# EasyEDA Pro project esp_4g_gp10-a.eprj

# Schematic Schematic1
Board Name: Board1; Create Date: 2025-06-18; Page Name: P1; Project Name: esp_4g_gp10-a; Schematic Name: Schematic1; Update Date: 2025-06-18; Company: 嘉立创EDA; Page Size: A4; Version: V1.0
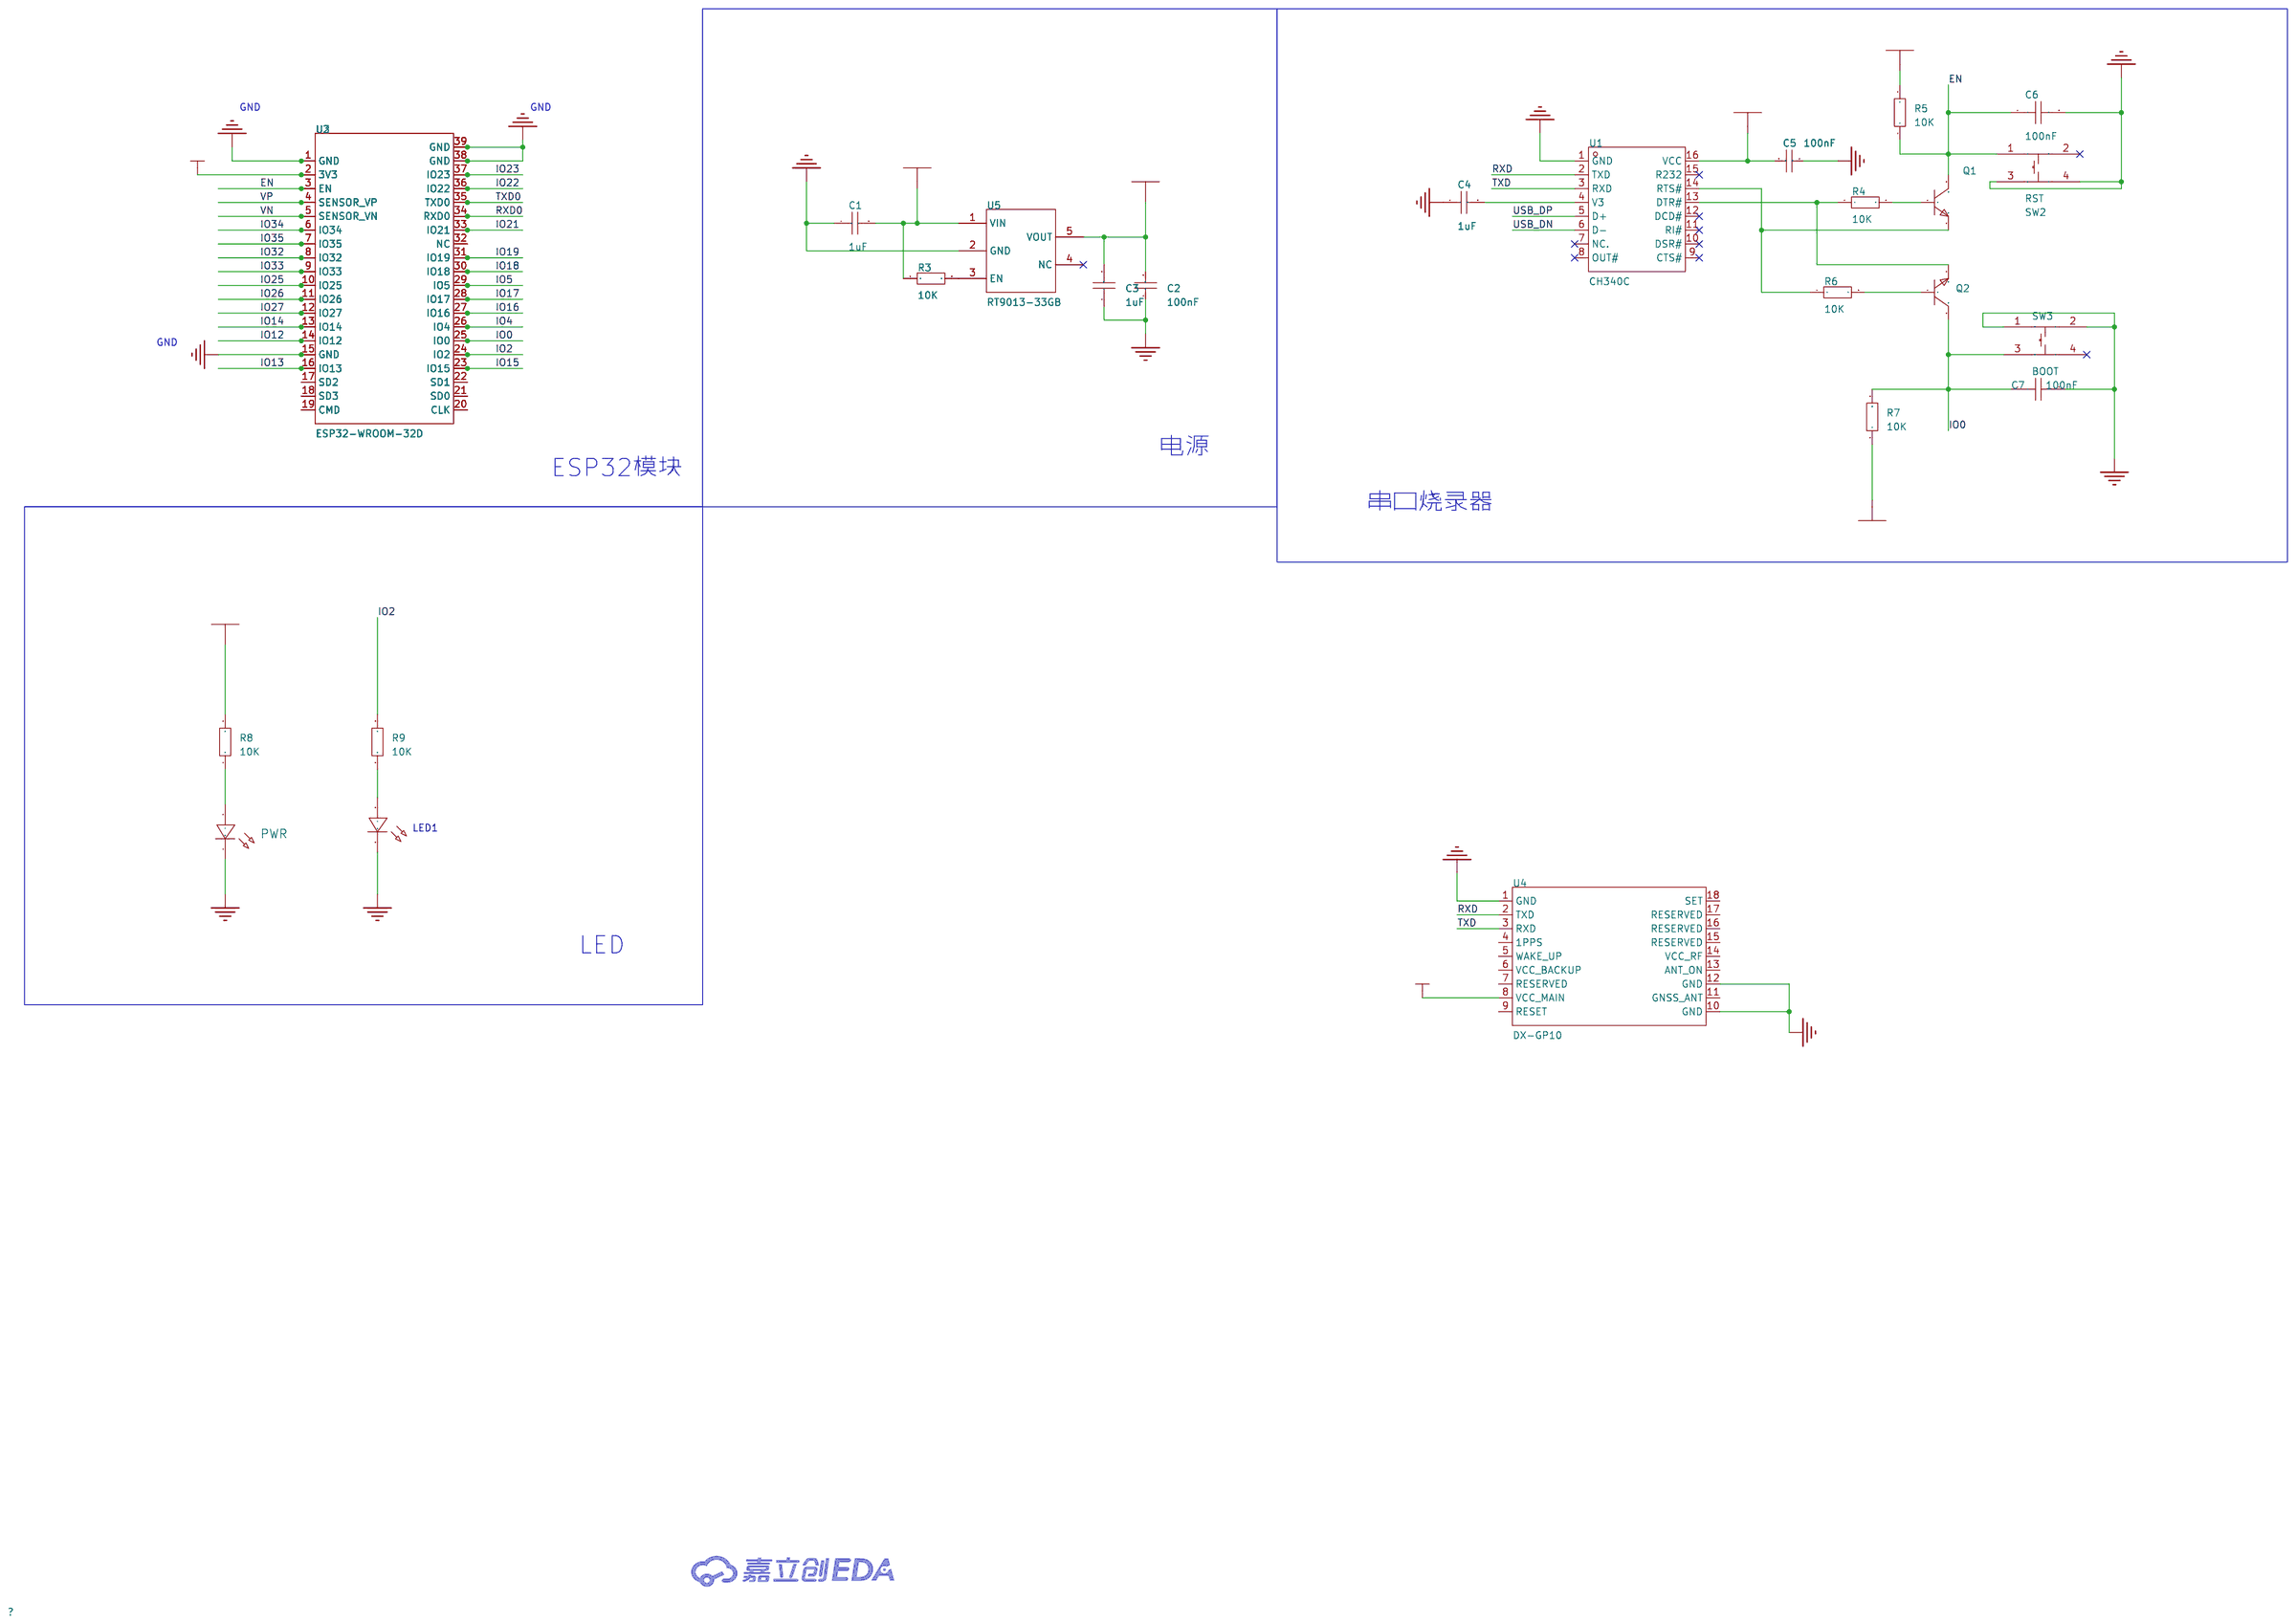
[diagram p0: schematic sheet]

## Parts
C1  1uF  [C0603]
C2  100nF  [C0402]
C3  1uF  [C0603]
C4  1uF  [C0603]
C5  100nF  [C0402]
C6  100nF  [C0603]
C7  100nF  [C0603]
LED1  -  [LED_0603]
PWR  -  [LED_0603]
Q1  -  [S8050_SOT-23]
Q2  -  [S8050_SOT-23]
R3  10K  [R0603]
R4  10K  [R0603]
R5  10K  [R0603]
R6  10K  [R0603]
R7  10K  [R0603]
R8  10K  [R0603]
R9  10K  [R0603]
SW2  RST  [KEY-SMD_4P-L4.2-W3.2-P2.20-LS4.6]
SW3  BOOT  [KEY-SMD_4P-L4.2-W3.2-P2.20-LS4.6]
U1  CH340C  [SOP-16_L10.0-W3.9-P1.27-LS6.0-BL]
U2  ESP32-WROOM-32D  [WIFIM-SMD_ESP32-WROOM-32D]
U3  ESP32-WROOM-32D  [WIFIM-SMD_ESP32-WROOM-32D]
U4  DX-GP10  [COMM-SMD_18P-L10.1-W9.7-P1.1-TL_L76-LB]
U5  RT9013-33GB  [SOT-23-5_L3.0-W1.7-P0.95-LS2.8-BL]

## Library data of the parts
C1 C3 C4 = 0603F105M250NT: LCSC Part Name: 1uF ±20% 25V; Supplier Part: C36577; Manufacturer: FH(风华); Supplier Footprint: 0603; JLCPCB Part Class: Extended Part; Datasheet: https://atta.szlcsc.com/upload/public/pdf/source/20170923/C36577_1506149443286988738.pdf; Supplier: LCSC; Tolerance: ±20%; Voltage Rated: 25V; Temperature Coefficient: Y5V
C2 C5 = 0402B104J160NT: LCSC Part Name: 100nF(104) ±5% 16V; Supplier Part: C507422; Manufacturer: FH(风华); Supplier Footprint: 0402; JLCPCB Part Class: Extended Part; Datasheet: https://atta.szlcsc.com/upload/public/pdf/source/20200305/C486355_26A10D38EF8C2A5C37091D0039909270.pdf; Supplier: LCSC; Temperature Coefficient: X7R; Tolerance: ±5%; Voltage Rated: 16V
C6 C7 = CAP_0603: Supplier Footprint: 0603
LED1 = LED_0603-G: Supplier Footprint: 0603
PWR = LED_0603-R: Supplier Footprint: 0603
Q1 Q2 = S8050_SOT_NPN: Supplier Footprint: SOT-23
R3-R9 = Res_0603: Supplier Footprint: 0603
SW2 SW3 = SKRPACE010: Supplier Part: C139797; Manufacturer: ALPSALPINE(阿尔卑斯阿尔派); Supplier Footprint: SMD; JLCPCB Part Class: Extended Part; Datasheet: https://atta.szlcsc.com/upload/public/pdf/source/20171113/C139797_15105612676371115729.pdf; Supplier: LCSC; Contact Current: 50mA; Voltage Rating (DC): 16V; Circuit: 单刀单掷; Mounting Style: 立贴; Actuator Style: 椭圆形按钮; Switch Length: 4.2mm; Switch Width: 3.2mm; Switch Height: 2.5mm
U1 = CH340C: Supplier Part: C84681; Manufacturer: WCH(南京沁恒); Supplier Footprint: SOP-16; JLCPCB Part Class: 扩展库; Datasheet: https://atta.szlcsc.com/upload/public/pdf/source/20240619/63986D8440D4E5267A77ACD891CC4DE3.pdf; Supplier: LCSC; Applications Function: 收发器; Protocol: USB 2.0; Voltage - Supply: 3.3V；5V; Data Rate: 2Mbps
U2 U3 = ESP32-WROOM-32D: Supplier Part: C503588; JLCPCB Part Class: 扩展库; Supplier: LCSC
U4 = DX-GP10: Supplier Part: C9900185251; Supplier Footprint: SMD,10.1X9.7mm; Supplier: LCSC
U5 = RT9013-33GB: LCSC Part Name: 输入5.5V 输出3.3V 500mA; Supplier Part: C47773; Manufacturer: RICHTEK(立锜); Supplier Footprint: SOT-23-5; JLCPCB Part Class: 扩展库; Datasheet: https://atta.szlcsc.com/upload/public/pdf/source/20150504/1457707282459.pdf; Supplier: LCSC; Output Type: 固定; Maximum Input Voltage: 5.5V; Output Voltage: 3.3V; Output Current: 500mA; Power Supply Rejection Ratio (PSRR): 50dB@(10kHz); Dropout Voltage: 400mV@(500mA); standby current: 50uA; Feature: 低ESR；防静电保护；热保护(TSD)；过流保护(OCP)；带使能; Operating Temperature: -40℃~+85℃; Output Polarity: 正极; Number of Outputs: 1

## Nets
3.3V: U2.2(3V3) U3.2(3V3)
3V3: C2.2 C3.2 R5.2 R7.1 R8.2 U5.5(VOUT)
GND: C1.1 C2.1 C3.1 C4.1 C5.1 C6.2 C7.2 LED1.1(C) PWR.1(C) SW2.3 SW2.4 SW3.1 SW3.2 U1.1(GND) U2.1(GND) U2.15(GND) U2.38(GND) U2.39(GND) U3.1(GND) U3.15(GND) U3.38(GND) U3.39(GND) U4.1(GND) U4.10(GND) U4.12(GND) U5.2(GND)
VBUS: C1.2 C5.2 R3.1 U1.16(VCC) U5.1(VIN)
VCC3.3V: U4.8(VCC_MAIN)
EN: C6.1 Q1.3 R5.1 SW2.1 U2.3(EN) U3.3(EN)
IO0: C7.1 Q2.3 R7.2 SW3.3 U2.25(IO0) U3.25(IO0)
IO2: R9.2 U2.24(IO2) U3.24(IO2)
IO4: U2.26(IO4) U3.26(IO4)
IO5: U2.29(IO5) U3.29(IO5)
IO12: U2.14(IO12) U3.14(IO12)
IO13: U2.16(IO13) U3.16(IO13)
IO14: U2.13(IO14) U3.13(IO14)
IO15: U2.23(IO15) U3.23(IO15)
IO16: U2.27(IO16) U3.27(IO16)
IO17: U2.28(IO17) U3.28(IO17)
IO18: U2.30(IO18) U3.30(IO18)
IO19: U2.31(IO19) U3.31(IO19)
IO21: U2.33(IO21) U3.33(IO21)
IO22: U2.36(IO22) U3.36(IO22)
IO23: U2.37(IO23) U3.37(IO23)
IO25: U2.10(IO25) U3.10(IO25)
IO26: U2.11(IO26) U3.11(IO26)
IO27: U2.12(IO27) U3.12(IO27)
IO32: U2.8(IO32) U3.8(IO32)
IO33: U2.9(IO33) U3.9(IO33)
IO34: U2.6(IO34) U3.6(IO34)
IO35: U2.7(IO35) U3.7(IO35)
RXD: U1.2(TXD) U4.2(TXD)
RXD0: U2.34(RXD0) U3.34(RXD0)
TXD: U1.3(RXD) U4.3(RXD)
TXD0: U2.35(TXD0) U3.35(TXD0)
USB_DN: U1.6(D-)
USB_DP: U1.5(D+)
VN: U2.5(SENSOR_VN) U3.5(SENSOR_VN)
VP: U2.4(SENSOR_VP) U3.4(SENSOR_VP)
Net-(C4-2): C4.2 U1.4(V3)
Net-(LED1-2): LED1.2(A) R9.1
Net-(PWR-2): PWR.2(A) R8.1
Net-(Q1-1): Q1.1 R4.2
Net-(Q1-2): Q1.2 R6.1 U1.14(RTS#)
Net-(Q2-1): Q2.1 R6.2
Net-(Q2-2): Q2.2 R4.1 U1.13(DTR#)
Net-(R3-2): R3.2 U5.3(EN)
Net-(U2-17): U2.17(SD2) U3.17(SD2)
Net-(U2-18): U2.18(SD3) U3.18(SD3)
Net-(U2-19): U2.19(CMD) U3.19(CMD)
Net-(U2-20): U2.20(CLK) U3.20(CLK)
Net-(U2-21): U2.21(SD0) U3.21(SD0)
Net-(U2-22): U2.22(SD1) U3.22(SD1)
Net-(U2-32): U2.32(NC) U3.32(NC)

Not connected (* = marked no-connect by the designer): SW2 2*; SW3 4*; U1 7(NC.)* 8(OUT#)* 9(CTS#)* 10(DSR#)* 11(RI#)* 12(DCD#)* 15(R232)*; U4 4(1PPS) 5(WAKE_UP) 6(VCC_BACKUP) 7(RESERVED) 9(RESET) 11(GNSS_ANT) 13(ANT_ON) 14(VCC_RF) 15(RESERVED) 16(RESERVED) 17(RESERVED) 18(SET); U5 4(NC)*

## Notes on the sheet
- GND
- GND
- GND
- 电源
- ESP32模块
- 串口烧录器
- LED
